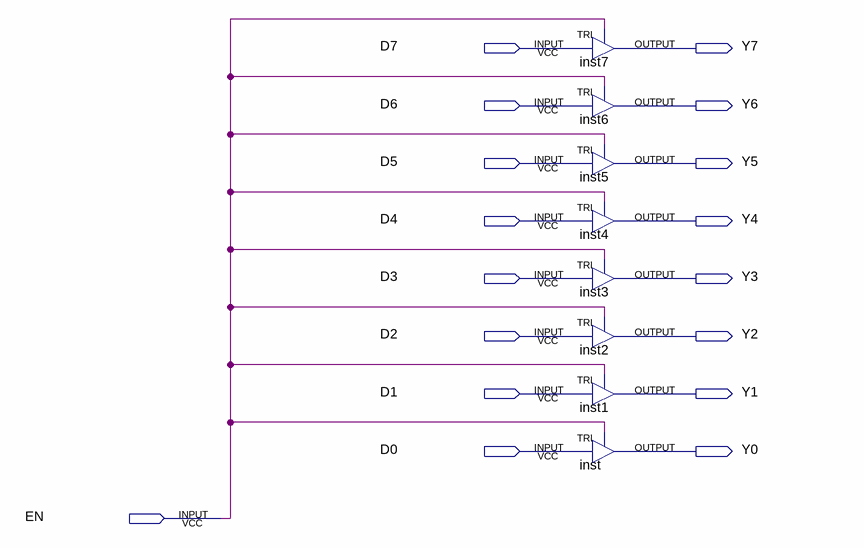
[diagram p0: schematic sheet]
// Quartus schematic isolate_8b.bdf as structural Verilog: 8 symbols, 17 pins
module isolate_8b (
  input  D7,
  input  D6,
  input  D5,
  input  D4,
  input  D3,
  input  D2,
  input  D1,
  input  D0,
  input  EN,
  output Y7,
  output Y6,
  output Y5,
  output Y4,
  output Y3,
  output Y2,
  output Y1,
  output Y0
);

  TRI inst7 (.IN(D7), .OE(EN), .OUT(Y7));
  TRI inst6 (.IN(D6), .OE(EN), .OUT(Y6));
  TRI inst5 (.IN(D5), .OE(EN), .OUT(Y5));
  TRI inst4 (.IN(D4), .OE(EN), .OUT(Y4));
  TRI inst3 (.IN(D3), .OE(EN), .OUT(Y3));
  TRI inst2 (.IN(D2), .OE(EN), .OUT(Y2));
  TRI inst1 (.IN(D1), .OE(EN), .OUT(Y1));
  TRI inst (.IN(D0), .OE(EN), .OUT(Y0));
endmodule
